# Altium schematic sheet 13.GPIO扩展接口.SchDoc
size A4; SheetNumber: 13; SheetTotal: 13
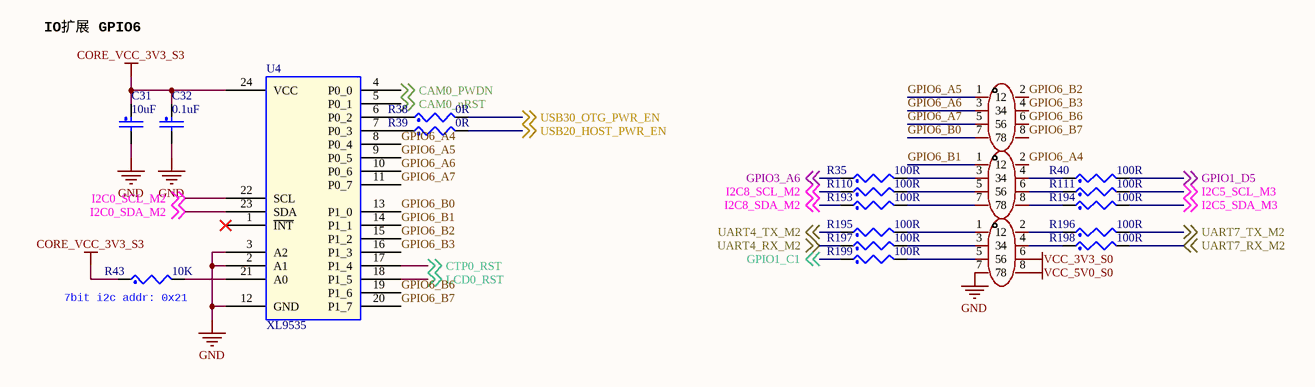
[diagram p0: 13.GPIO扩展接口.SchDoc]

## Parts
C31  10uF  [C0402]
C32  0.1uF  [C0402]
H1  HX PZ2.0-2x4P WT  [HDR-SMD_HX-PZ2.0-2X4P-WT]  (value not drawn)
H2  HX PZ2.0-2x4P WT  [HDR-SMD_HX-PZ2.0-2X4P-WT]  (value not drawn)
H3  HX PZ2.0-2x4P WT  [HDR-SMD_HX-PZ2.0-2X4P-WT]  (value not drawn)
R35  100R  [R0402]
R38  0R  [R0402]
R39  0R  [R0402]
R40  100R  [R0402]
R43  10K  [R0402]
R110  100R  [R0402]
R111  100R  [R0402]
R193  100R  [R0402]
R194  100R  [R0402]
R195  100R  [R0402]
R196  100R  [R0402]
R197  100R  [R0402]
R198  100R  [R0402]
R199  100R  [R0402]
U4  XL9535  [TSSOP24-0R65-7R80X4R40]

## Nets
CORE_VCC_3V3_S3: C31.1 C32.1 R43.1 U4.24(VCC)
GND: C31.2 C32.2 H3.7 U4.2(A1) U4.3(A2) U4.12(GND)
VCC_3V3_S0: H3.6
VCC_5V0_S0: H3.8
CAM0_nRST: U4.5(P0_1) ; off-sheet CAM0_nRST
CAM0_PWDN: U4.4(P0_0) ; off-sheet CAM0_PWDN
CTP0_RST: U4.17(P1_4) ; off-sheet CTP0_RST
GPIO1_C1: R199.1 ; off-sheet GPIO1_C1
GPIO1_D5: R40.2 ; off-sheet GPIO1_D5
GPIO3_A6: R35.1 ; off-sheet GPIO3_A6
GPIO6_A4: H2.2 U4.8(P0_4)
GPIO6_A5: H1.1 U4.9(P0_5)
GPIO6_A6: H1.3 U4.10(P0_6)
GPIO6_A7: H1.5 U4.11(P0_7)
GPIO6_B0: H1.7 U4.13(P1_0)
GPIO6_B1: H2.1 U4.14(P1_1)
GPIO6_B2: H1.2 U4.15(P1_2)
GPIO6_B3: H1.4 U4.16(P1_3)
GPIO6_B6: H1.6 U4.19(P1_6)
GPIO6_B7: H1.8 U4.20(P1_7)
I2C0_SCL_M2: U4.22(SCL) ; off-sheet I2C0_SCL_M2
I2C0_SDA_M2: U4.23(SDA) ; off-sheet I2C0_SDA_M2
I2C5_SCL_M3: R111.2 ; off-sheet I2C5_SCL_M3
I2C5_SDA_M3: R194.2 ; off-sheet I2C5_SDA_M3
I2C8_SCL_M2: R110.1 ; off-sheet I2C8_SCL_M2
I2C8_SDA_M2: R193.1 ; off-sheet I2C8_SDA_M2
LCD0_RST: U4.18(P1_5) ; off-sheet LCD0_RST
UART4_RX_M2: R197.1 ; off-sheet UART4_RX_M2
UART4_TX_M2: R195.1 ; off-sheet UART4_TX_M2
UART7_RX_M2: R198.2 ; off-sheet UART7_RX_M2
UART7_TX_M2: R196.2 ; off-sheet UART7_TX_M2
USB20_HOST_PWR_EN: R39.2 ; off-sheet USB20_HOST_PWR_EN
USB30_OTG_PWR_EN: R38.2 ; off-sheet USB30_OTG_PWR_EN
NetH2_3: H2.3 R35.2
NetH2_4: H2.4 R40.1
NetH2_5: H2.5 R110.2
NetH2_6: H2.6 R111.1
NetH2_7: H2.7 R193.2
NetH2_8: H2.8 R194.1
NetH3_1: H3.1 R195.2
NetH3_2: H3.2 R196.1
NetH3_3: H3.3 R197.2
NetH3_4: H3.4 R198.1
NetH3_5: H3.5 R199.2
NetR38_1: R38.1 U4.6(P0_2)
NetR39_1: R39.1 U4.7(P0_3)
NetR43_2: R43.2 U4.21(A0)

Not connected (* = marked no-connect by the designer): U4 1(~{INT})*

## Notes on the sheet
- IO扩展 GPIO6
- (near R43) 7bit i2c addr: 0x21

## Library data of the parts
C31 C32 = CAP_NP
R35 R38-R40 R43 R110 R111 R193-R199 = RES